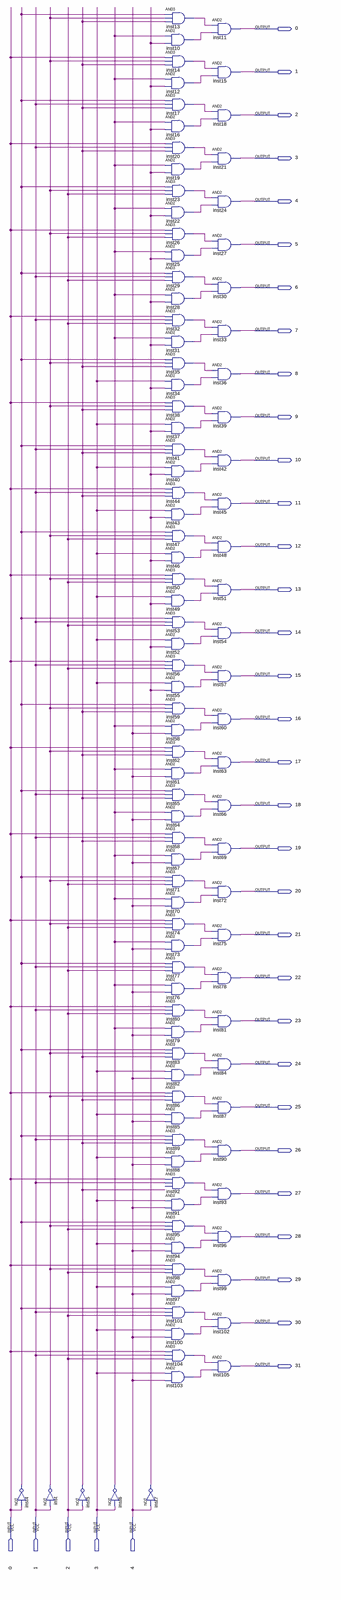
[diagram p0: schematic sheet, whole]
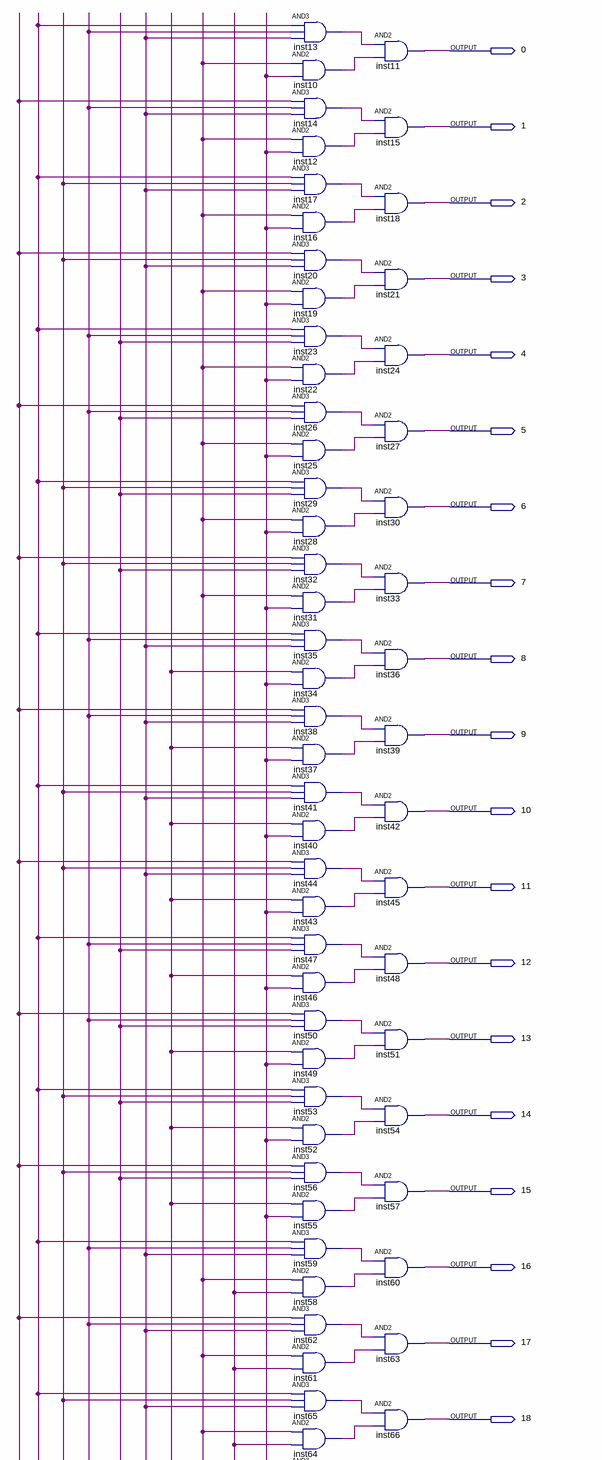
[diagram p1: schematic sheet, upper part]
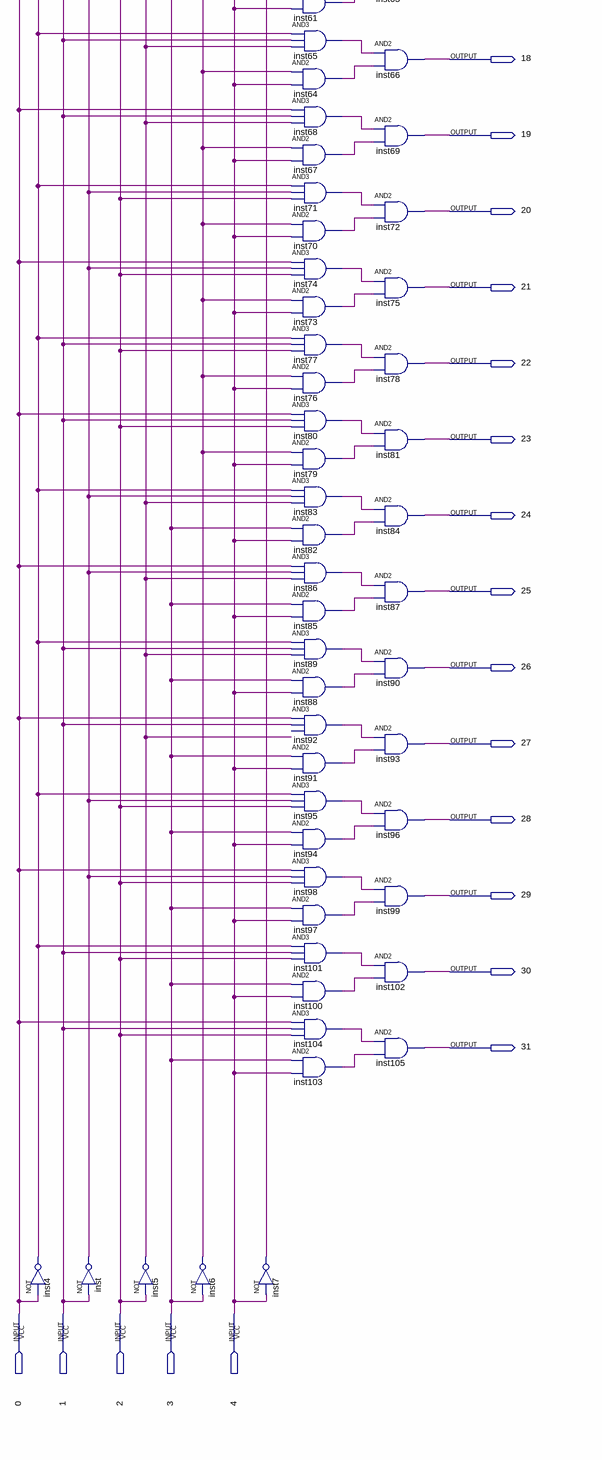
[diagram p2: schematic sheet, lower part]
// Quartus schematic decod.bdf as structural Verilog: 101 symbols, 37 pins
module decod (
  inout  \0 ,
  inout  \1 ,
  inout  \2 ,
  inout  \3 ,
  inout  \4 ,
  output \5 ,
  output \6 ,
  output \7 ,
  output \8 ,
  output \9 ,
  output \10 ,
  output \11 ,
  output \12 ,
  output \13 ,
  output \14 ,
  output \15 ,
  output \16 ,
  output \17 ,
  output \18 ,
  output \19 ,
  output \20 ,
  output \21 ,
  output \22 ,
  output \23 ,
  output \24 ,
  output \25 ,
  output \26 ,
  output \27 ,
  output \28 ,
  output \29 ,
  output \30 ,
  output \31 
);

  wire inst4_out, inst5_out, inst6_out, inst7_out, inst10_out, inst12_out, inst13_out, inst14_out,
       inst16_out, inst17_out, inst19_out, inst20_out, inst22_out, inst23_out, inst25_out, inst26_out,
       inst28_out, inst29_out, inst31_out, inst32_out, inst34_out, inst35_out, inst37_out, inst38_out,
       inst40_out, inst41_out, inst43_out, inst44_out, inst46_out, inst47_out, inst49_out, inst50_out,
       inst52_out, inst53_out, inst55_out, inst56_out, inst58_out, inst59_out, inst61_out, inst62_out,
       inst64_out, inst65_out, inst67_out, inst68_out, inst70_out, inst71_out, inst73_out, inst74_out,
       inst76_out, inst77_out, inst79_out, inst80_out, inst82_out, inst83_out, inst85_out, inst86_out,
       inst88_out, inst89_out, inst91_out, inst92_out, inst94_out, inst95_out, inst97_out, inst98_out,
       inst100_out, inst101_out, inst103_out, inst104_out, inst_out;

  not inst4 (inst4_out, \0 );
  not inst (inst_out, \1 );
  not inst5 (inst5_out, \2 );
  not inst6 (inst6_out, \3 );
  and inst13 (inst13_out, inst4_out, inst_out, inst5_out);
  and inst10 (inst10_out, inst6_out, inst7_out);
  and inst14 (inst14_out, \0 , inst_out, inst5_out);
  and inst12 (inst12_out, inst6_out, inst7_out);
  and inst17 (inst17_out, inst4_out, \1 , inst5_out);
  and inst16 (inst16_out, inst6_out, inst7_out);
  and inst20 (inst20_out, \0 , \1 , inst5_out);
  and inst19 (inst19_out, inst6_out, inst7_out);
  and inst23 (inst23_out, inst4_out, inst_out, \2 );
  and inst22 (inst22_out, inst6_out, inst7_out);
  and inst26 (inst26_out, \0 , inst_out, \2 );
  and inst25 (inst25_out, inst6_out, inst7_out);
  and inst29 (inst29_out, inst4_out, \1 , \2 );
  and inst28 (inst28_out, inst6_out, inst7_out);
  and inst32 (inst32_out, \0 , \1 , \2 );
  and inst31 (inst31_out, inst6_out, inst7_out);
  and inst35 (inst35_out, inst4_out, inst_out, inst5_out);
  and inst34 (inst34_out, \3 , inst7_out);
  and inst38 (inst38_out, \0 , inst_out, inst5_out);
  and inst37 (inst37_out, \3 , inst7_out);
  and inst41 (inst41_out, inst4_out, \1 , inst5_out);
  and inst40 (inst40_out, \3 , inst7_out);
  and inst44 (inst44_out, \0 , \1 , inst5_out);
  and inst43 (inst43_out, \3 , inst7_out);
  and inst47 (inst47_out, inst4_out, inst_out, \2 );
  and inst46 (inst46_out, \3 , inst7_out);
  and inst50 (inst50_out, \0 , inst_out, \2 );
  and inst49 (inst49_out, \3 , inst7_out);
  and inst53 (inst53_out, inst4_out, \1 , \2 );
  and inst52 (inst52_out, \3 , inst7_out);
  and inst56 (inst56_out, \0 , \1 , \2 );
  and inst55 (inst55_out, \3 , inst7_out);
  and inst59 (inst59_out, inst4_out, inst_out, inst5_out);
  and inst58 (inst58_out, inst6_out, \4 );
  and inst62 (inst62_out, \0 , inst_out, inst5_out);
  and inst61 (inst61_out, inst6_out, \4 );
  and inst65 (inst65_out, inst4_out, \1 , inst5_out);
  and inst64 (inst64_out, inst6_out, \4 );
  and inst68 (inst68_out, \0 , \1 , inst5_out);
  and inst67 (inst67_out, inst6_out, \4 );
  and inst71 (inst71_out, inst4_out, inst_out, \2 );
  and inst70 (inst70_out, inst6_out, \4 );
  and inst74 (inst74_out, \0 , inst_out, \2 );
  and inst73 (inst73_out, inst6_out, \4 );
  and inst77 (inst77_out, inst4_out, \1 , \2 );
  and inst76 (inst76_out, inst6_out, \4 );
  and inst80 (inst80_out, \0 , \1 , \2 );
  and inst79 (inst79_out, inst6_out, \4 );
  and inst83 (inst83_out, inst4_out, inst_out, inst5_out);
  and inst82 (inst82_out, \3 , \4 );
  and inst86 (inst86_out, \0 , inst_out, inst5_out);
  and inst85 (inst85_out, \3 , \4 );
  and inst89 (inst89_out, inst4_out, \1 , inst5_out);
  and inst88 (inst88_out, \3 , \4 );
  and inst92 (inst92_out, \0 , \1 );  // open: IN3
  and inst91 (inst91_out, \3 , \4 );
  and inst95 (inst95_out, inst4_out, inst_out, \2 );
  and inst94 (inst94_out, \3 , \4 );
  and inst98 (inst98_out, \0 , inst_out, \2 );
  and inst97 (inst97_out, \3 , \4 );
  and inst101 (inst101_out, inst4_out, \1 , \2 );
  and inst100 (inst100_out, \3 , \4 );
  and inst104 (inst104_out, \0 , \1 , \2 );
  and inst103 (inst103_out, \3 , \4 );
  not inst7 (inst7_out, \4 );
  and inst11 (\0 , inst13_out, inst10_out);
  and inst15 (\1 , inst14_out, inst12_out);
  and inst18 (\2 , inst17_out, inst16_out);
  and inst21 (\3 , inst20_out, inst19_out);
  and inst24 (\4 , inst23_out, inst22_out);
  and inst27 (\5 , inst26_out, inst25_out);
  and inst30 (\6 , inst29_out, inst28_out);
  and inst33 (\7 , inst32_out, inst31_out);
  and inst36 (\8 , inst35_out, inst34_out);
  and inst39 (\9 , inst38_out, inst37_out);
  and inst42 (\10 , inst41_out, inst40_out);
  and inst45 (\11 , inst44_out, inst43_out);
  and inst48 (\12 , inst47_out, inst46_out);
  and inst51 (\13 , inst50_out, inst49_out);
  and inst54 (\14 , inst53_out, inst52_out);
  and inst57 (\15 , inst56_out, inst55_out);
  and inst60 (\16 , inst59_out, inst58_out);
  and inst63 (\17 , inst62_out, inst61_out);
  and inst66 (\18 , inst65_out, inst64_out);
  and inst69 (\19 , inst68_out, inst67_out);
  and inst72 (\20 , inst71_out, inst70_out);
  and inst75 (\21 , inst74_out, inst73_out);
  and inst78 (\22 , inst77_out, inst76_out);
  and inst81 (\23 , inst80_out, inst79_out);
  and inst84 (\24 , inst83_out, inst82_out);
  and inst87 (\25 , inst86_out, inst85_out);
  and inst90 (\26 , inst89_out, inst88_out);
  and inst93 (\27 , inst92_out, inst91_out);
  and inst96 (\28 , inst95_out, inst94_out);
  and inst99 (\29 , inst98_out, inst97_out);
  and inst102 (\30 , inst101_out, inst100_out);
  and inst105 (\31 , inst104_out, inst103_out);
endmodule
